# Altium schematic sheet Connector.SchDoc
size B; Author: E. Sims; Organization: Let's Build Rockets Inc.; SheetNumber: 2; SheetTotal: 6
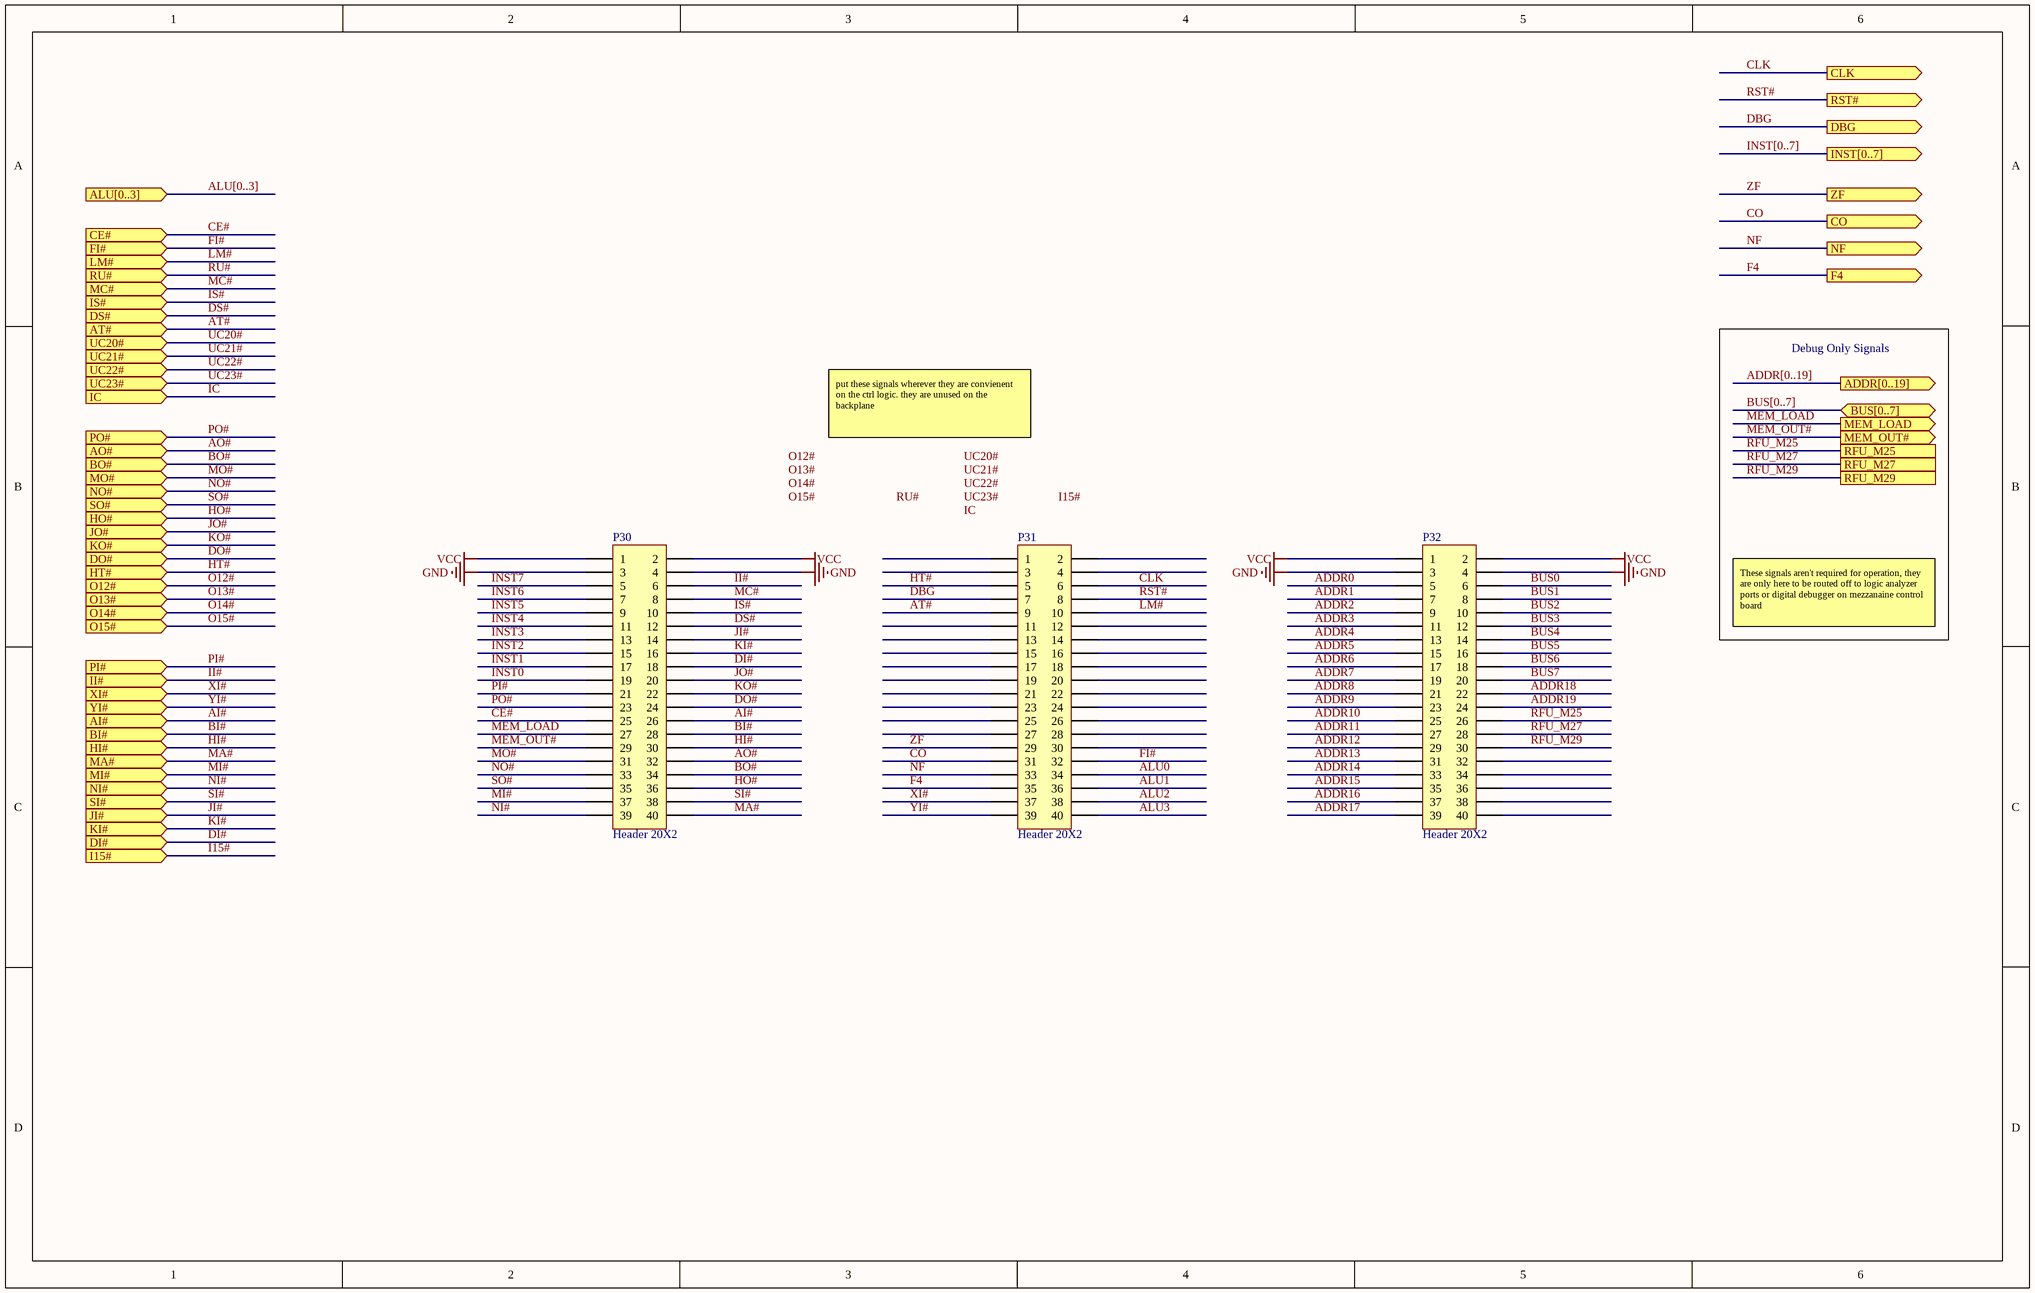
[diagram p0: Connector.SchDoc]

## Parts
P30  Header 20X2  [HDR2X20]
P31  Header 20X2  [HDR2X20]
P32  Header 20X2  [HDR2X20]

## Ports
ADDR[0..19] (out), AI# (in), ALU[0..3] (in), AO# (in), AT# (in), BI# (in), BO# (in), BUS[0..7] (bidir), CE# (in), CLK (out), CO (out), DBG (out), DI# (in), DO# (in), DS# (in), F4 (out), FI# (in), HI# (in), HO# (in), HT# (in), I15# (in), IC (in), II# (in), INST[0..7] (out), IS# (in), JI# (in), JO# (in), KI# (in), KO# (in), LM# (in), MA# (in), MC# (in), MEM_LOAD (out), MEM_OUT# (out), MI# (in), MO# (in), NF (out), NI# (in), NO# (in), O12# (in), O13# (in), O14# (in), O15# (in), PI# (in), PO# (in), RFU_M25, RFU_M27, RFU_M29, RST# (out), RU# (in), SI# (in), SO# (in), UC20# (in), UC21# (in), UC22# (in), UC23# (in), XI# (in), YI# (in), ZF (out)

## Nets
GND: P30.3 P30.4 P32.3 P32.4
VCC: P30.1 P30.2 P32.1 P32.2
ADDR0: P32.5
ADDR1: P32.7
ADDR2: P32.9
ADDR3: P32.11
ADDR4: P32.13
ADDR5: P32.15
ADDR6: P32.17
ADDR7: P32.19
ADDR8: P32.21
ADDR9: P32.23
ADDR10: P32.25
ADDR11: P32.27
ADDR12: P32.29
ADDR13: P32.31
ADDR14: P32.33
ADDR15: P32.35
ADDR16: P32.37
ADDR17: P32.39
ADDR18: P32.22
ADDR19: P32.24
AI#: P30.26 ; port AI#
ALU0: P31.34
ALU1: P31.36
ALU2: P31.38
ALU3: P31.40
AO#: P30.32 ; port AO#
AT#: P31.9 ; port AT#
BI#: P30.28 ; port BI#
BO#: P30.34 ; port BO#
BUS0: P32.6
BUS1: P32.8
BUS2: P32.10
BUS3: P32.12
BUS4: P32.14
BUS5: P32.16
BUS6: P32.18
BUS7: P32.20
CE#: P30.25 ; port CE#
CLK: P31.6 ; port CLK
CO: P31.31 ; port CO
DBG: P31.7 ; port DBG
DI#: P30.18 ; port DI#
DO#: P30.24 ; port DO#
DS#: P30.12 ; port DS#
F4: P31.35 ; port F4
FI#: P31.32 ; port FI#
HI#: P30.30 ; port HI#
HO#: P30.36 ; port HO#
HT#: P31.5 ; port HT#
I15#: port I15#
IC: port IC
II#: P30.6 ; port II#
INST0: P30.19
INST1: P30.17
INST2: P30.15
INST3: P30.13
INST4: P30.11
INST5: P30.9
INST6: P30.7
INST7: P30.5
IS#: P30.10 ; port IS#
JI#: P30.14 ; port JI#
JO#: P30.20 ; port JO#
KI#: P30.16 ; port KI#
KO#: P30.22 ; port KO#
LM#: P31.10 ; port LM#
MA#: P30.40 ; port MA#
MC#: P30.8 ; port MC#
MEM_LOAD: P30.27 ; port MEM_LOAD
MEM_OUT#: P30.29 ; port MEM_OUT#
MI#: P30.37 ; port MI#
MO#: P30.31 ; port MO#
NF: P31.33 ; port NF
NI#: P30.39 ; port NI#
NO#: P30.33 ; port NO#
O12#: port O12#
O13#: port O13#
O14#: port O14#
O15#: port O15#
PI#: P30.21 ; port PI#
PO#: P30.23 ; port PO#
RFU_M25: P32.26 ; port RFU_M25
RFU_M27: P32.28 ; port RFU_M27
RFU_M29: P32.30 ; port RFU_M29
RST#: P31.8 ; port RST#
RU#: port RU#
SI#: P30.38 ; port SI#
SO#: P30.35 ; port SO#
UC20#: port UC20#
UC21#: port UC21#
UC22#: port UC22#
UC23#: port UC23#
XI#: P31.37 ; port XI#
YI#: P31.39 ; port YI#
ZF: P31.29 ; port ZF

Not connected (* = marked no-connect by the designer): P31 1 2 3 4 11 12 13 14 15 16 17 18 19 20 21 22 23 24 25 26 27 28 30; P32 32 34 36 38 40

## Buses and harness runs
bus ADDR[0..19] = port ADDR[0..19]
bus ALU[0..3] = port ALU[0..3]
bus BUS[0..7] = port BUS[0..7]
bus INST[0..7] = port INST[0..7]

## Notes on the sheet
- Debug Only Signals
- put these signals wherever they are convienent on the ctrl logic. they are unused on the backplane
- These signals aren't required for operation, they are only here to be routed off to logic analyzer ports or digital debugger on mezzanaine control board
- Labels drawn without touching a wire or pin: I15#, IC, O12#, O13#, O14#, O15#, RU#, UC20#, UC21#, UC22#, UC23#
- Let's Build Rocket's Inc. Modular Paylaod System Based on TMP-010 Rev
  For more information visit https://github.com/LetsBuildRockets/Modular-Payload-System
  This work is licensed under CC BY-NC 4.0. To view a copy of this license, visit https://creativecommons.org/licenses/by-nc/4.0
- Title
- Size:
- Date:
- Assembly Variant:
- B
- Number:
- Time:
- Revision:
- Sheet
- of
- Author:
- File:

## Library data of the parts
P30-P32 = Header 20X2: Header, 20-Pin, Dual row; System: Connector; LatestRevisionDate: 17-Jul-2002; LatestRevisionNote: Re-released for DXP Platform.; Publisher: Altium Limited